# Altium project 2024_WSB.PrjPcb (part 3 of 3)

## Sheet Power.SchDoc
size A; SheetNumber: 11; SheetTotal: 11
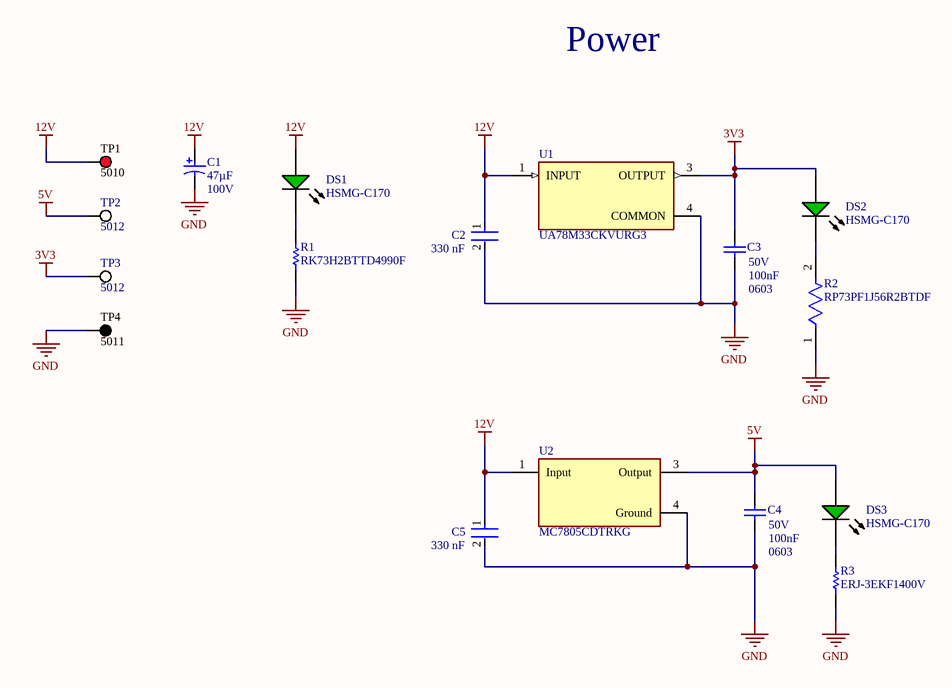
[diagram p10: Power.SchDoc]

### Parts
C1  Capacitance: 47µF  Voltage: 100V  [NIC-UUX2A470MNL1GS_L]  (hidden comment: UUX2A470MNL1GS)
C2  value 330 nF  [FP-CC0805-0_85-MFG]  (hidden comment: CC0805KKX7R7BB334)
C3  Case Code (Imperial): 0603  Capacitance: 100nF  Voltage: 50V  [CAPC1608X87X35NL15T15]  (hidden comment: C0603X104K5RACTU)
C4  Case Code (Imperial): 0603  Capacitance: 100nF  Voltage: 50V  [CAPC1608X87X35NL15T15]  (hidden comment: C0603X104K5RACTU)
C5  value 330 nF  [FP-CC0805-0_85-MFG]  (hidden comment: CC0805KKX7R7BB334)
DS1  HSMG-C170  [AVAG-HSMX-C170_V]
DS2  HSMG-C170  [AVAG-HSMX-C170_V]
DS3  HSMG-C170  [AVAG-HSMX-C170_V]
R1  RK73H2BTTD4990F  [RESC3216X70X40NL20T20]
R2  RP73PF1J56R2BTDF  [FP-RP73P-1J-MFG]
R3  ERJ-3EKF1400V  [RESC1608X55X30NL15T15]
TP1  5010  [KSTN-5010_V]
TP2  5012  [KSTN-5012_V]
TP3  5012  [KSTN-5012_V]
TP4  5011  [KSTN-5011_V]
U1  UA78M33CKVURG3  [FP-KVU0003A-MFG]
U2  MC7805CDTRKG  [FP-369C-MFG]

### Nets
3V3: C3.2 DS2.1(A) TP3.1 U1.3(OUTPUT)
5V: C4.2 DS3.1(A) TP2.1 U2.3(Output)
12V: C1.1 C2.1 C5.1 DS1.1(A) TP1.1 U1.1(INPUT) U2.1(Input)
GND: C1.2 C2.2 C3.1 C4.1 C5.2 R1.1 R2.1 R3.1 TP4.1 U1.4(COMMON) U2.4(Ground)
NetDS1_2: DS1.2(K) R1.2
NetDS2_2: DS2.2(K) R2.2
NetDS3_2: DS3.2(K) R3.2

### Notes on the sheet
- Power

### Library data of the parts
C1 = CMP-2000-07372-1: Aluminum Electrolytic Capacitor, 47 uF, +/- 20%, 100 VDC, -55 to 105 degC, 2-Pin SMD, RoHS, Tape and Reel; Manufacturer: Nichicon; Type: Can; Leakage Current: 141uA; Dissipation Factor: 0.08%; Ripple Current: 230mA; Life (Hours): 2000Hour; Lead Diameter: 1.1mm; Dielectric Material: Aluminium; Polarity: Polarized; Tan Delta: 0.08; Package Description: 2-Pin Aluminum Electrolytic Capacitor, Body 10.3 x 10.3 mm; Datasheet Version: 08/2015; Case Size/Dimension: Ø10x10mm; Mounting Technology: SurfaceMount; Operating Temp-Max: 105°C; Datasheet URL: http://products.nichicon.co.jp/en/pdf/XJA043/e-uux.pdf; Manufacturer URL: http://www.nichicon.co.jp/english/; Package Reference: UUX2A470MNL1GS; Rated Voltage: 100V; Supplier 1: Digi-Key; Supplier Part Number 1: 493-9631-1-ND; Manufacturer Part Number: UUX2A470MNL1GS; Stock 1: 24372; Pricing 1: 1 = 0.720000, 10 = 0.507000, 100 = 0.333800 (USD); RoHS: Yes; Mount: Surface Mount; Case/Package: Radial; Min Operating Temperature: -55°C; Max Operating Temperature: 105°C; Tolerance: 20%; Packaging: Tape and Reel; Voltage Rating: 100V; Voltage Rating (DC): 100V; Termination: SMD/SMT; Package Quantity: 500; Ripple Current (AC): 230mA; Features: General Purpose; Diameter: 10mm; Length: 10mm; Height: 10mm; Height - Seated (Max): 0.394inch; Lead Pitch: 4.5mm; Radiation Hardening: No; REACH SVHC: No SVHC; Supplier 2: Digikey; Supplier Part Number 2: 493-9631-6-ND; Category: Aluminum Electrolytic Capacitors; Pricing 2: 1=0.65, 10=0.455, 50=0.383, 100=0.3118 (USD); Number of Pins: 2; Package Shape: Cylindrical; Size Code: 4141; Terminal Finish: Tin; JESD-609 Code: e6; Capacitor Type: Aluminium; Negative Tolerance: 20%; Package Style: SMTMeter; Positive Tolerance: 20%; Rated DC Voltage (URdc): 100V; Width: 10.3mm; Reach SVHC Compliant: No; RoHS Compliant: Yes; ComponentLink1URL: https://datasheet.ciiva.com:443/pdfs/VipMasterIC/IC/NICH/NICH-S-A0009252175/NICH-S-A0009252175-1.pdf?src-supplier=IHS+Markit; ComponentLink1Description: https://datasheet.ciiva.com:443/pdfs/VipMasterIC/IC/NICH/NICH-S-A0009252175/NICH-S-A0009252175-1.pdf?src-supplier=IHS+Markit; ComponentLink2URL: https://datasheet.ciiva.com/30522/getdatasheetpartid-544485-30522138.pdf?src-supplier=Verical; ComponentLink2Description: https://datasheet.ciiva.com/30522/getdatasheetpartid-544485-30522138.pdf?src-supplier=Verical; ComponentLink3URL: https://datasheet.ciiva.com/11781/0900766b80fa3a40-11781984.pdf?src-supplier=Rs; ComponentLink3Description: https://datasheet.ciiva.com/11781/0900766b80fa3a40-11781984.pdf?src-supplier=Rs; ComponentLink4URL: https://datasheet.ciiva.com/5361/e-ux-11104-5361317.pdf?src-supplier=Mouser; ComponentLink4Description: https://datasheet.ciiva.com/5361/e-ux-11104-5361317.pdf?src-supplier=Mouser; ComponentLink5URL: https://datasheet.ciiva.com/7907/e-ux-7907500.pdf?src-supplier=Element14; ComponentLink5Description: https://datasheet.ciiva.com/7907/e-ux-7907500.pdf?src-supplier=Element14; ComponentLink6URL: https://datasheet.ciiva.com/28458/1913003-28458341.pdf?src-supplier=Element14; ComponentLink6Description: https://datasheet.ciiva.com/28458/1913003-28458341.pdf?src-supplier=Element14
C2 C5 = CMP-03422-000882-1: Surface Mount Ceramic Multilayer Capacitor 0.33uF 10% X7R 16V 0805 Blister T/R; Manufacturer: Yageo; Tolerance: 0.1; Height: 0.95mm; Automotive: No; Footprint Url: http://www.yageo.com/exep/pages/download/literatures/UPY-C_GEN_24.pdf; Temperature Characteristic: X7R; Device Class L3: Ceramic Capacitors; Category: Cap; Temperature Range High: +85°C; Manufacturer Part Number: CC0805KKX7R7BB334; Temperature Range Low: -30°C; ComponentLink2URL: http://www.yageo.com/documents/recent/UPY-GPHC_Y5V_6.3V-to-50V_8.pdf; Lead Free: Yes; Device Class L2: Capacitors; Package: CC0805-0.85; Material: Ceramic; Voltage Rating: 16 V; Device Class L1: Passive Components; Ipc Land Pattern Name: CAPC200125X85; Mouser Description: Multilayer Ceramic Capacitors MLCC - SMD/SMT 330nF 16V X7R 10%; Octopart: https://octopart.com/cc0805kkx7r7bb334-yageo-42334127; Capacitance: 330 nF; Temperature: -30°C to +85°C; ComponentLink2Description: Datasheet; Digikey Description: Surface Mount Ceramic Multilayer Capacitor 0.33uF 10% X7R 16V 0805 Blister T/R; RoHS: TRUE
C3 C4 = CMP-2006-03300-1: Manufacturer: Kemet; Dielectric Material: Ceramic; Tolerance: 10%; Dielectric: X7R; Dissipation Factor: 2.5%; Part Number: C0603X104K5RACTU; Supplier 1: Digi-Key; Supplier Part Number 1: 399-7969-1-ND; Manufacturer Part Number: C0603X104K5RACTU; Stock 1: 2206541; Pricing 1: 1 = 0.21000, 10 = 0.14500, 100 = 0.07340, 500 = 0.05024, 1000 = 0.04444 (USD); RoHS: Yes; Mount: Surface Mount; Case/Package: 0603; Number of Pins: 2; Case Code (Metric): 1608; Min Operating Temperature: -55°C; Max Operating Temperature: 125°C; Voltage Rating: 50V; Packaging: Tape and Reel; Package Quantity: 1; Voltage Rating (DC): 50V; Termination: SMD/SMT; Features: Soft Termination; Length: 1.6mm; Height: 0.8mm; Width: 0.8mm; Depth: 0.8mm; Thickness: 0.034inch; Radiation Hardening: No; REACH SVHC: No SVHC; ComponentLink1URL: https://datasheet.ciiva.com/7823/1776088-7823908.pdf?src-supplier=Element14; ComponentLink1Description: https://datasheet.ciiva.com/7823/1776088-7823908.pdf?src-supplier=Element14; ComponentLink2URL: https://datasheet.ciiva.com/26948/getdatasheetpartid-385607-26948458.pdf?src-supplier=Verical; ComponentLink2Description: https://datasheet.ciiva.com/26948/getdatasheetpartid-385607-26948458.pdf?src-supplier=Verical; ComponentLink3URL: https://datasheet.ciiva.com/7823/1776088-7823909.pdf?src-supplier=Element14; ComponentLink3Description: https://datasheet.ciiva.com/7823/1776088-7823909.pdf?src-supplier=Element14; ComponentLink4URL: https://datasheet.ciiva.com/6279/kem-c1013-x7r-ft-cap-smd-6279993.pdf?src-supplier=Digi-Key; ComponentLink4Description: https://datasheet.ciiva.com/6279/kem-c1013-x7r-ft-cap-smd-6279993.pdf?src-supplier=Digi-Key; ComponentLink5URL: https://datasheet.ciiva.com/28533/1918693-28533212.pdf?src-supplier=Element14; ComponentLink5Description: https://datasheet.ciiva.com/28533/1918693-28533212.pdf?src-supplier=Element14; ComponentLink6URL: https://datasheet.ciiva.com/6279/kem-c1013-x7r-ft-cap-smd-6279999.pdf?src-supplier=Digi-Key; ComponentLink6Description: https://datasheet.ciiva.com/6279/kem-c1013-x7r-ft-cap-smd-6279999.pdf?src-supplier=Digi-Key; ComponentLink7URL: https://datasheet.ciiva.com/6279/kem-c1013-x7r-ft-cap-smd-6279990.pdf?src-supplier=Digi-Key; ComponentLink7Description: https://datasheet.ciiva.com/6279/kem-c1013-x7r-ft-cap-smd-6279990.pdf?src-supplier=Digi-Key; ComponentLink8URL: https://datasheet.ciiva.com/14597/70096394-14597743.pdf?src-supplier=Allied+Electronics; ComponentLink8Description: https://datasheet.ciiva.com/14597/70096394-14597743.pdf?src-supplier=Allied+Electronics
DS1-DS3 = CMP-2000-05062-1: Chip LED, Green, 2.2 V, -40 to 85 degC, 2-Pin SMD, Pb-Free, Tape and Reel; Manufacturer: Avago; No. of Pins: 2; Peak Wavelength: 570nm; SVHC: NoSVHC(16-Jun-2014); Dominant Wavelength: 572nm; Forward Current If: 20mA; Viewing Angle: 170deg; Lens Shape: Rectangular; PIV Max: 5V; External Width: 1.25mm; LED Type: Standard; External Depth: 0.8mm; Opto Mounting Orientation: Top; Luminous Intensity: 15mcd; Luminous Intensity Min: 4mcd; Forward Voltage VF Max: 2.6V; External Length / Height: 2mm; Bulb Size: 1.25mmx1.4mm; Light Area Height: 1mm; Voltage Vf Typ: 2.2V; Operating Temperature Max: 85degC; Datasheet Version: Oct-08; MSL: MSL2A-4weeks; Peak Forward Current: 20mA; Package Description: 2-Pin Surface Mount Device, Body 2 x 1.25 mm, Height 0.8 mm; Datasheet URL: https://datasheet.ciiva.com/29280/180495-da-01-en-chip-led-hsmg-c170-gelb-gruen-29280971.pdf; Storage Temperature Min: -40degC; LED Colour: Green; Wavelength Typ: 570nm; Mounting Type: SMD; Forward Current If Max: 20mA; Dominant Wavelength Typ: 572nm; LED Mounting: SMD; Operating Temperature Range: -30degCto+85degC; Operating Temperature Min: -30degC; Manufacturer URL: http://www.avagotech.com/; Packaging: CutTape; Luminous Intensity Typ: 15mcd; Package Reference: HSMX-C170; Storage Temperature Max: 85degC; Opto Case Style: SMD; Forward Voltage: 2.2V
R1 = CMP-2003-01022-1: Manufacturer: KOA Speer; Part Number: RK73H2BTTD4990F
R2 = CMP-03211-004918-1: RES SMD 56.2 OHM 0.1% 1/6W 0603; Manufacturer: TE Connectivity; Resistance: 56.2Ω; Value: 56.2Ω; Power Rating: 0.166W; Voltage Rating: 100V; Temperature Coefficient: 25ppm/°C; Tolerance: 0.001; ComponentLink2URL: https://www.te.com/commerce/DocumentDelivery/DDEController?Action=srchrtrv&DocNm=1773272&DocType=DS&DocLang=English; RoHS: TRUE; Temperature Range Low: -55°C; Octopart: https://octopart.com/rp73pf1j56r2btdf-te+connectivity-45466141; Ipc Land Pattern Name: RESC15580X45; Automotive: No; Category: Res; Lead Free: Yes; Device Class L2: Resistors; Device Class L3: Chip SMD Resistors; Temperature: -55°C to +155°C; Digikey Description: RES SMD 56.2 OHM 0.1% 1/6W 0603; ComponentLink2Description: Datasheet; Manufacturer Part Number: RP73PF1J56R2BTDF; Device Class L1: Passive Components; Composition: Thin Film; Series: RP73P; Temperature Range High: +155°C; Height: 0.55mm; Package: RP73P-1J
R3 = CMP-2000-00245-1: Manufacturer: Panasonic; Part Number: ERJ-3EKF1400V
TP1 = CMP-1672-00002-4: Test Point, Red, Through Hole, RoHS, Bulk; Manufacturer: Keystone; Contact Material: Bronze; Mounting Technology: Through Hole; RoHSCompliant: true; Pins: 1; Package Quantity: 100; ComponentLink2Description: Datasheet; Height: 8.12 mm; ComponentLink1URL: http://www.keyelco.com/; DatasheetVersion: Rev. F, 12/2013; Mount: Through Hole; PackageReference: 5010; Contact Plating: Silver; Packaging: Bulk; Colour: Red; REACH SVHC: No SVHC; PackageDescription: 1-Pin Through Hole Device, Dia 3.17 mm; ComponentLink2URL: http://www.keyelco.com/product-pdf.cfm?p=1319; ComponentLink1Description: Manufacturer URL
TP2 TP3 = CMP-1672-00004-4: Test Point, White, Through Hole, RoHS, Bulk; Manufacturer: Keystone; DatasheetVersion: Rev. F, 12/2013; ComponentLink1URL: http://www.keyelco.com/; PackageReference: 5012; RoHSCompliant: true; ComponentLink2Description: Datasheet; Colour: White; Contact Material: Bronze; PackageDescription: 1-Pin Through Hole Device, Dia 3.17 mm; Mounting Technology: Through Hole; Mount: Through Hole; Package Quantity: 100; ComponentLink1Description: Manufacturer URL; Pins: 1; Height: 8.12 mm; Packaging: Bulk; REACH SVHC: No SVHC; Contact Plating: Silver; Length: 11.3 mm; ComponentLink2URL: http://www.keyelco.com/product-pdf.cfm?p=1321
TP4 = CMP-1672-00003-4: Test Point, Black, Through Hole, RoHS, Bulk; Manufacturer: Keystone; ComponentLink2URL: http://www.keyelco.com/product-pdf.cfm?p=1320; Colour: Black; Pins: 1; REACH SVHC: No SVHC; ComponentLink1URL: http://www.keyelco.com/; PackageReference: 5011; Contact Plating: Silver; Package Quantity: 100; Packaging: Bulk; RoHSCompliant: true; Height: 8.12 mm; PackageDescription: 1-Pin Through Hole Device, Dia 3.17 mm; Mount: Through Hole; Mounting Technology: Through Hole; DatasheetVersion: Rev. F, 12/2013; ComponentLink1Description: Manufacturer URL; Contact Material: Bronze; ComponentLink2Description: Datasheet
U1 = CMP-04917-000046-1: IC REG LINEAR 3.3V 500MA TO252-3; Manufacturer: Texas Instruments; Nominal Supply Current: 4.5mA; Output Type: Fixed; Dropout Voltage: 2V; Number Of Outputs: 1; Max Supply Voltage: 25V; Standoff Height: 0mm; Max Junction Temp: +125°C; Accuracy Percentage: 3%; Min Supply Voltage: 5.3V; Temperature: 0°C to +125°C; Automotive: No; Package: KVU0003A; Category: IC; Output Current: 500mA; RoHS: TRUE; ComponentLink2Description: Datasheet; ComponentLink2URL: http://www.ti.com/lit/ds/symlink/ua78m.pdf; Height: 2.65mm; Output Voltage: 3.3V; Octopart: https://octopart.com/ua78m33ckvurg3-texas+instruments-669262; Mouser Description: Linear Voltage Regulators 3.3 V 500mA Fix Pos Voltage Regulator; Device Class L3: Voltage Regulators - Linear; Lead Free: Yes; Device Class L2: Power Management ICs; Device Class L1: Integrated Circuits (ICs); Digikey Description: IC REG LINEAR 3.3V 500MA TO252-3; Temperature Range Low: 0°C; Manufacturer Part Number: UA78M33CKVURG3; Temperature Range High: +125°C
U2 = CMP-07128-000033-1: IC REG LINEAR 5V 1A DPAK; Max Output Voltage: 5.2V; Dropout Voltage: 2V; Accuracy: 4%; Number of Regulators: 1; Min Input Voltage: 10V; Max Input Voltage: 35V; Output Type: Fixed; Power Supply Rejection Ratio (PSRR): 83dB; Polarity: Positive; Quiescent Current: 3.2mA; Mount: Surface Mount; Number of Pins: 3; Nominal Output Voltage: 5V; Lead Free: Lead Free; Contact Plating: Tin; Packaging: Tape and Reel; Max Output Current: 1A; Width: 6.22mm; Min Operating Temperature: 0°C; Min Output Voltage: 5V; Max Operating Temperature: 125°C; Halogen Free: Halogen Free; Output Current: 1A; Output Voltage: 5V; Case/Package: DPAK; Radiation Hardening: No; Number of Outputs: 1; Height: 2.38mm; Package Quantity: 1; REACH SVHC: No SVHC; Output Voltage Accuracy: 4%; Length: 6.73mm

## Nets that join several sheets
3V3: MicroSD (7 pins), Programming (J1.8 R9.2), CAN (C24.1 U4.3 U4.5), Processor (26 pins), U_MainConnector/U_SensorPower2 (R71A.1), U_MainConnector/U_SensorPower1 (R71B.1), U_MainConnector/U_SensorPower3 (R71C.1), U_MainConnector/U_I2CSensorPower1 (R71D.1), U_MainConnector/U_I2CSensorPower2 (R71E.1), U_MainConnector/U_SPISensorPower1 (R71F.1), U_MainConnector/U_SPISensorPower2 (R71G.1), Ethernet (25 pins), Power (C3.2 DS2.1 TP3.1 U1.3)
5V: U_MainConnector/U_SensorPower2 (R70A.1), U_MainConnector/U_SensorPower1 (R70B.1), U_MainConnector/U_SensorPower3 (R70C.1), U_MainConnector/U_I2CSensorPower1 (R70D.1), U_MainConnector/U_I2CSensorPower2 (R70E.1), U_MainConnector/U_SPISensorPower1 (R70F.1), U_MainConnector/U_SPISensorPower2 (R70G.1), Power (C4.2 DS3.1 TP2.1 U2.3)
12V: MainConnector (J3.24), U_MainConnector/U_SensorPower2 (R69A.1), U_MainConnector/U_SensorPower1 (R69B.1), U_MainConnector/U_SensorPower3 (R69C.1), U_MainConnector/U_I2CSensorPower1 (R69D.1), U_MainConnector/U_I2CSensorPower2 (R69E.1), U_MainConnector/U_SPISensorPower1 (R69F.1), U_MainConnector/U_SPISensorPower2 (R69G.1), Power (7 pins)
GND: MicroSD (9 pins), Programming (10 pins), CAN (C24.2 D3.3 U4.2 U4.8), Oscillator (C22.1 C23.1), Processor (22 pins), MainConnector (8 pins), U_MainConnector/U_SensorInput1 (5 pins), U_MainConnector/U_SensorInput2 (5 pins), U_MainConnector/U_SensorInput3 (5 pins), U_MainConnector/U_SensorPower2 (C39A.2 C40A.2), U_MainConnector/U_SensorPower1 (C39B.2 C40B.2), U_MainConnector/U_SensorPower3 (C39C.2 C40C.2), U_MainConnector/U_I2CSensorPower1 (C39D.2 C40D.2), U_MainConnector/U_I2CSensorPower2 (C39E.2 C40E.2), U_MainConnector/U_SPISensorPower1 (C39F.2 C40F.2), U_MainConnector/U_SPISensorPower2 (C39G.2 C40G.2), Ethernet (26 pins), Power (11 pins)
CAN_CONN_H: CAN (D3.2 U4.7), MainConnector (J3.8)
CAN_CONN_L: CAN (D3.1 U4.6), MainConnector (J3.9)
I2C1_PWR: MainConnector (J3.31), U_MainConnector/U_I2CSensorPower1 (5 pins)
I2C2_PWR: MainConnector (J3.30), U_MainConnector/U_I2CSensorPower2 (5 pins)
I2C_SCL: Processor (R5.1 U3.95), MainConnector (J3.19 R40.2 TP6.1)
I2C_SDA: Processor (R4.1 U3.96), MainConnector (J3.20 R41.2 TP9.1)
MII_MDC: Processor (U3.16), Ethernet (IC1.31)
MII_MDIO: Processor (U3.25), Ethernet (IC1.30 R22.1)
NetC22_2: Oscillator (C22.2 Y1.1), Processor (U3.12)
NetD5A_1: MainConnector (R47.2 R48.2 TP11.1), U_MainConnector/U_SensorInput1 (D5A.1 R61A.1 R65A.1 R66A.2)
NetD5B_1: MainConnector (R49.2 R50.2 TP13.1), U_MainConnector/U_SensorInput2 (D5B.1 R61B.1 R65B.1 R66B.2)
NetD5C_1: MainConnector (R51.2 R52.2 TP14.1), U_MainConnector/U_SensorInput3 (D5C.1 R61C.1 R65C.1 R66C.2)
NetIC1_7: Processor (U3.56), Ethernet (IC1.7)
NetIC1_29: Processor (U3.8), Ethernet (IC1.29 R21.1)
NetIC1_41: Processor (U3.30), Ethernet (IC1.41)
NetR6_1: Programming (SW3.1), Processor (R6.1 U3.4)
NetR7_1: Programming (SW2.1), Processor (R7.1 U3.3)
NetR10_1: Oscillator (R10.1), Processor (U3.13)
NetR11_1: Processor (U3.33), Ethernet (R11.1)
NetR12_1: Processor (U3.51), Ethernet (R12.1)
NetR13_1: Processor (U3.34), Ethernet (R13.1)
NetR14_1: Processor (U3.52), Ethernet (R14.1)
NetR15_1: Processor (U3.35), Ethernet (R15.1)
NetR16_1: Processor (U3.17), Ethernet (R16.1)
NetR17_1: Processor (U3.36), Ethernet (R17.1)
NetR18_1: Processor (U3.1), Ethernet (R18.1)
NetR19_1: Processor (U3.18), Ethernet (R19.1)
NetR20_1: Processor (U3.48), Ethernet (R20.1)
NetR23_1: Processor (U3.23), Ethernet (R23.1)
NetR24_1: Processor (U3.32), Ethernet (R24.1)
NetR25_1: Processor (U3.24), Ethernet (R25.1)
NetR26_1: Processor (U3.26), Ethernet (R26.1)
NetR45_1: Processor (U3.93), MainConnector (R45.1)
NetR46_2: Processor (U3.92), MainConnector (R46.2)
NetR47_1: Processor (U3.29), MainConnector (R47.1)
NetR48_1: Processor (U3.40), MainConnector (R48.1)
NetR49_1: Processor (U3.31), MainConnector (R49.1)
NetR50_1: Processor (U3.42), MainConnector (R50.1)
NetR51_1: Processor (U3.15), MainConnector (R51.1)
NetR52_1: Processor (U3.44), MainConnector (R52.1)
NetR58_2: MicroSD (R58.2 R59.1), Processor (U3.67)
NetU3_81: CAN (U4.4), Processor (U3.81)
NetU3_82: CAN (U4.1), Processor (U3.82)
RESET: Programming (6 pins), Processor (U3.14)
SD_CK: MicroSD (J4.P5), Processor (U3.80)
SD_CMD: MicroSD (J4.P3 R57.1), Processor (U3.83)
SD_D0: MicroSD (J4.P7 R53.1), Processor (U3.65)
SD_D1: MicroSD (J4.P8 R54.1), Processor (U3.66)
SD_D2: MicroSD (J4.P1 R55.1), Processor (U3.78)
SD_D3: MicroSD (J4.P2 R56.1), Processor (U3.79)
SENSOR1_IN: MainConnector (J3.11), U_MainConnector/U_SensorInput1 (R60A.2 R62A.2)
SENSOR1_PWR: MainConnector (J3.34), U_MainConnector/U_SensorPower1 (5 pins)
SENSOR2_IN: MainConnector (J3.12), U_MainConnector/U_SensorInput2 (R60B.2 R62B.2)
SENSOR2_PWR: MainConnector (J3.35), U_MainConnector/U_SensorPower2 (5 pins)
SENSOR3_IN: MainConnector (J3.10), U_MainConnector/U_SensorInput3 (R60C.2 R62C.2)
SENSOR3_PWR: MainConnector (J3.33), U_MainConnector/U_SensorPower3 (5 pins)
SPI1_PWR: MainConnector (J3.28), U_MainConnector/U_SPISensorPower1 (5 pins)
SPI2_PWR: MainConnector (J3.1), U_MainConnector/U_SPISensorPower2 (5 pins)
SPI_MISO: Processor (U3.90), MainConnector (J3.16 R44.1 TP12.1)
SPI_MOSI: Processor (U3.91), MainConnector (J3.5 R38.2 TP8.1)
SPI_SCK: Processor (U3.89), MainConnector (J3.4 R39.1 TP5.1)
SWCLK: Programming (D1.3 J1.6), Processor (U3.76)
SWDIO: Programming (D1.1 J1.7), Processor (U3.72)
UART_DGB2MCU: Programming (D2.1 J1.3), Processor (U3.69)
UART_MCU2DGB: Programming (D2.3 J1.2), Processor (U3.68)
USART_RX: Processor (U3.87), MainConnector (R42.1 TP10.1)
USART_TX: Processor (U3.86), MainConnector (R43.1 TP7.1)
USB_BOARD_N: MicroSD (J5.2), Processor (U3.70)
USB_BOARD_P: MicroSD (J5.3), Processor (U3.71)

## Assembly variants
2024_WSB: not fitted R56A R56B R56C R58A R58B R58C R59A R59B R59C R62A R62B R62C R63A R63B R63C R64A R64B R64C R64D R64E R64F R64G R65C R66A R66A R66B R66B R66C R66D R66E R66F R66G R69A R69B R69C R69E R69F R69G R70C R70D R70F R71A R71B R71D R71E R71G